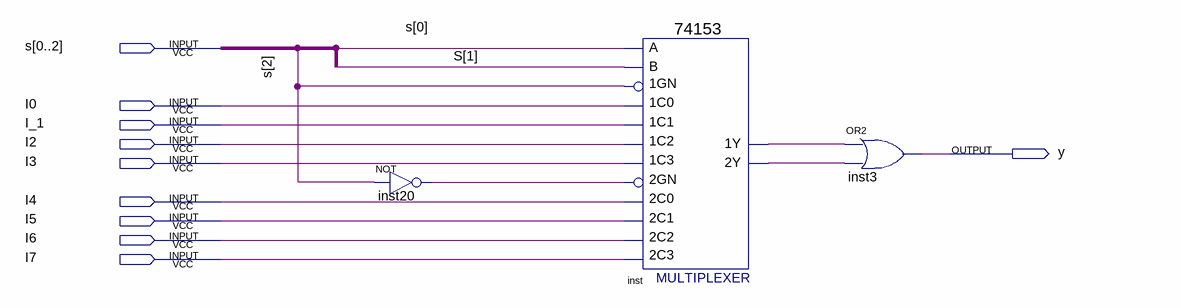
[diagram p0: schematic sheet]
// Quartus schematic exercicio_1.bdf as structural Verilog: 3 symbols, 10 pins
module exercicio_1 (
  input  [0:2] s,
  input  I0,
  input  I_1,
  input  I2,
  input  I3,
  input  I4,
  input  I5,
  input  I6,
  input  I7,
  output y
);

  wire inst20_out, inst_1y, inst_2y;

  not inst20 (inst20_out, s[2]);
  \74153  inst (
    .\1C1 (I_1), .\1GN (s[2]), .\1C0 (I0), .\2C0 (I4), .\2GN (inst20_out), .\2C2 (I6), .\1C2 (I2),
    .\1C3 (I3), .B(s[1]), .A(s[0]), .\2C1 (I5), .\2C3 (I7), .\1Y (inst_1y), .\2Y (inst_2y));
  or inst3 (y, inst_1y, inst_2y);
endmodule
